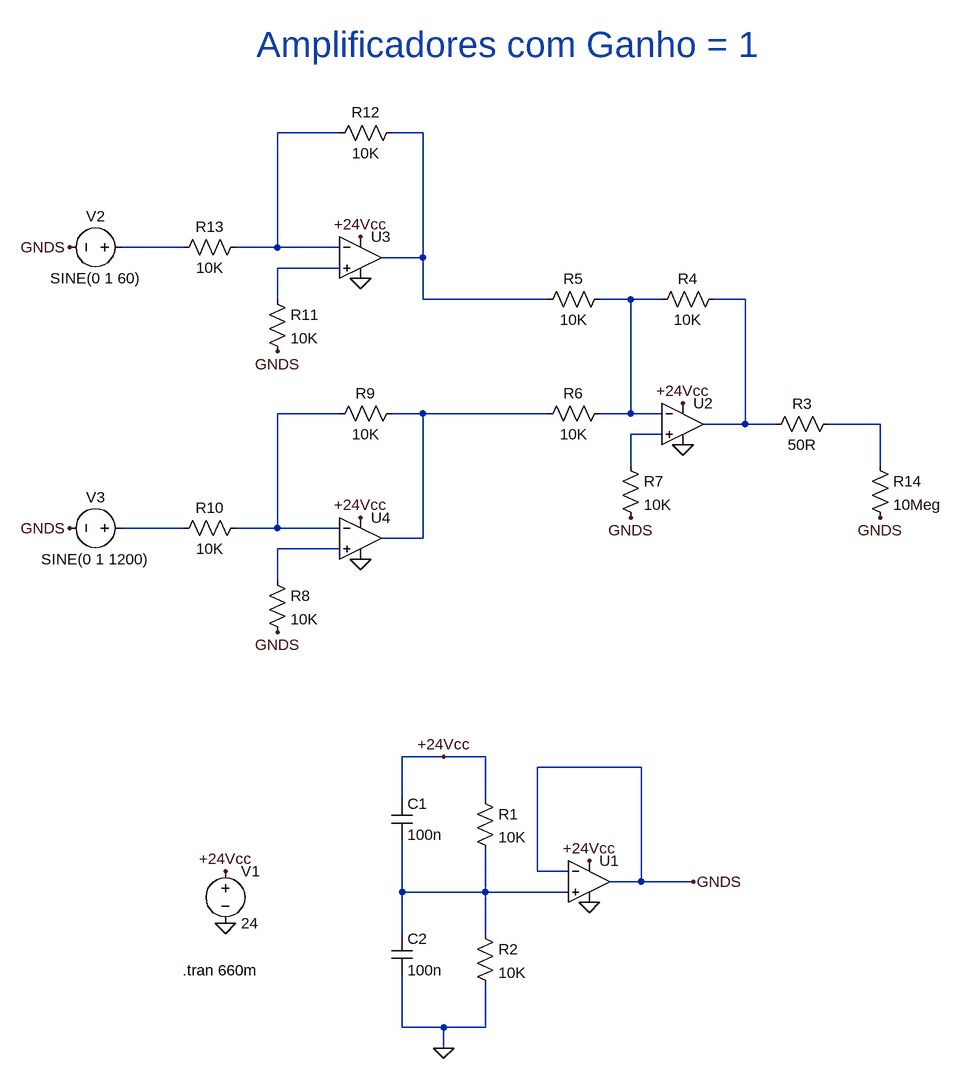
[diagram p0: schematic Simulacao_do_circuito.asc]
Simulacao_do_circuito.asc, the LTspice schematic file:
Version 4
SHEET 1 880 680
WIRE -192 -1168 -288 -1168
WIRE -64 -1168 -112 -1168
WIRE -432 -992 -528 -992
WIRE -288 -992 -288 -1168
WIRE -288 -992 -352 -992
WIRE -192 -992 -288 -992
WIRE -64 -976 -64 -1168
WIRE -64 -976 -128 -976
WIRE -192 -960 -288 -960
WIRE -288 -912 -288 -960
WIRE -64 -912 -64 -976
WIRE 128 -912 -64 -912
WIRE 256 -912 208 -912
WIRE 304 -912 256 -912
WIRE 432 -912 384 -912
WIRE -192 -736 -288 -736
WIRE -64 -736 -112 -736
WIRE 128 -736 -64 -736
WIRE 256 -736 256 -912
WIRE 256 -736 208 -736
WIRE 304 -736 256 -736
WIRE 432 -720 432 -912
WIRE 432 -720 368 -720
WIRE 480 -720 432 -720
WIRE 640 -720 560 -720
WIRE 304 -704 256 -704
WIRE 256 -656 256 -704
WIRE 640 -656 640 -720
WIRE -432 -560 -528 -560
WIRE -288 -560 -288 -736
WIRE -288 -560 -352 -560
WIRE -192 -560 -288 -560
WIRE -64 -544 -64 -736
WIRE -64 -544 -128 -544
WIRE -192 -528 -288 -528
WIRE -288 -480 -288 -528
WIRE -32 -208 -96 -208
WIRE 32 -208 -32 -208
WIRE 272 -192 112 -192
WIRE -96 -144 -96 -208
WIRE 32 -144 32 -208
WIRE 112 -32 112 -192
WIRE 160 -32 112 -32
WIRE 272 -16 272 -192
WIRE 272 -16 224 -16
WIRE 352 -16 272 -16
WIRE -96 0 -96 -80
WIRE 32 0 32 -64
WIRE 32 0 -96 0
WIRE 160 0 32 0
WIRE -96 64 -96 0
WIRE 32 64 32 0
WIRE -96 208 -96 128
WIRE -32 208 -96 208
WIRE 32 208 32 144
WIRE 32 208 -32 208
WIRE -32 240 -32 208
FLAG 336 -752 +24Vcc
FLAG 192 -48 +24Vcc
FLAG -160 -576 +24Vcc
FLAG -160 -512 0
FLAG 192 16 0
FLAG 336 -688 0
FLAG -32 240 0
FLAG -32 -208 +24Vcc
FLAG 352 -16 GNDS
FLAG -368 48 0
FLAG -368 -32 +24Vcc
FLAG 256 -576 GNDS
FLAG -288 -400 GNDS
FLAG -160 -1008 +24Vcc
FLAG -160 -944 0
FLAG -288 -832 GNDS
FLAG 640 -576 GNDS
FLAG -608 -992 GNDS
FLAG -608 -560 GNDS
SYMBOL OpAmps\\UniversalOpAmp 192 -16 R0
SYMATTR InstName U1
SYMBOL OpAmps\\UniversalOpAmp 336 -720 R0
SYMATTR InstName U2
SYMBOL OpAmps\\UniversalOpAmp -160 -544 R0
SYMATTR InstName U4
SYMBOL res 16 -160 R0
SYMATTR InstName R1
SYMATTR Value 10K
SYMBOL res 16 48 R0
SYMATTR InstName R2
SYMATTR Value 10K
SYMBOL cap -112 -144 R0
SYMATTR InstName C1
SYMATTR Value 100n
SYMBOL cap -112 64 R0
SYMATTR InstName C2
SYMATTR Value 100n
SYMBOL voltage -368 -48 R0
WINDOW 123 0 0 Left 0
WINDOW 39 0 0 Left 0
SYMATTR InstName V1
SYMATTR Value 24
SYMBOL res 576 -736 R90
WINDOW 0 0 56 VBottom 2
WINDOW 3 32 56 VTop 2
SYMATTR InstName R3
SYMATTR Value 50R
SYMBOL res 400 -928 R90
WINDOW 0 0 56 VBottom 2
WINDOW 3 32 56 VTop 2
SYMATTR InstName R4
SYMATTR Value 10K
SYMBOL res 224 -928 R90
WINDOW 0 0 56 VBottom 2
WINDOW 3 32 56 VTop 2
SYMATTR InstName R5
SYMATTR Value 10K
SYMBOL res 224 -752 R90
WINDOW 0 0 56 VBottom 2
WINDOW 3 32 56 VTop 2
SYMATTR InstName R6
SYMATTR Value 10K
SYMBOL res 240 -672 R0
SYMATTR InstName R7
SYMATTR Value 10K
SYMBOL res -304 -496 R0
SYMATTR InstName R8
SYMATTR Value 10K
SYMBOL res -96 -752 R90
WINDOW 0 0 56 VBottom 2
WINDOW 3 32 56 VTop 2
SYMATTR InstName R9
SYMATTR Value 10K
SYMBOL res -336 -576 R90
WINDOW 0 0 56 VBottom 2
WINDOW 3 32 56 VTop 2
SYMATTR InstName R10
SYMATTR Value 10K
SYMBOL OpAmps\\UniversalOpAmp -160 -976 R0
SYMATTR InstName U3
SYMBOL res -304 -928 R0
SYMATTR InstName R11
SYMATTR Value 10K
SYMBOL res -96 -1184 R90
WINDOW 0 0 56 VBottom 2
WINDOW 3 32 56 VTop 2
SYMATTR InstName R12
SYMATTR Value 10K
SYMBOL res -336 -1008 R90
WINDOW 0 0 56 VBottom 2
WINDOW 3 32 56 VTop 2
SYMATTR InstName R13
SYMATTR Value 10K
SYMBOL res 624 -672 R0
SYMATTR InstName R14
SYMATTR Value 10Meg
SYMBOL voltage -512 -992 R90
WINDOW 0 -32 56 VBottom 2
WINDOW 3 32 56 VTop 2
WINDOW 123 0 0 Left 0
WINDOW 39 0 0 Left 0
SYMATTR InstName V2
SYMATTR Value SINE(0 1 60)
SYMBOL voltage -512 -560 R90
WINDOW 0 -32 56 VBottom 2
WINDOW 3 32 56 VTop 2
WINDOW 123 0 0 Left 0
WINDOW 39 0 0 Left 0
SYMATTR InstName V3
SYMATTR Value SINE(0 1 1200)
TEXT -434 120 Left 2 !.tran 660m
TEXT -320 -1304 Left 5 ;Amplificadores com Ganho = 1

The netlist it stands for:
* Simulacao_do_circuito.asc
XU1 N013 GNDS +24Vcc 0 GNDS level1 Avol=1Meg GBW=10Meg Vos=0 En=0 Enk=0 In=0 Ink=0 Rin=500Meg  ; pins In+ In- V+ V- OUT
XU2 N010 N005 +24Vcc 0 N006 level1 Avol=1Meg GBW=10Meg Vos=0 En=0 Enk=0 In=0 Ink=0 Rin=500Meg  ; pins In+ In- V+ V- OUT
XU4 N012 N007 +24Vcc 0 N008 level1 Avol=1Meg GBW=10Meg Vos=0 En=0 Enk=0 In=0 Ink=0 Rin=500Meg  ; pins In+ In- V+ V- OUT
R1 +24Vcc N013 10K
R2 N013 0 10K
C1 +24Vcc N013 100n
C2 N013 0 100n
V1 +24Vcc 0 24
R3 N009 N006 50R
R4 N006 N005 10K
R5 N005 N002 10K
R6 N005 N008 10K
R7 N010 GNDS 10K
R8 N012 GNDS 10K
R9 N008 N007 10K
R10 N007 N011 10K
XU3 N004 N001 +24Vcc 0 N002 level1 Avol=1Meg GBW=10Meg Vos=0 En=0 Enk=0 In=0 Ink=0 Rin=500Meg  ; pins In+ In- V+ V- OUT
R11 N004 GNDS 10K
R12 N002 N001 10K
R13 N001 N003 10K
R14 N009 GNDS 10Meg
V2 N003 GNDS SINE(0 1 60)
V3 N011 GNDS SINE(0 1 1200)
.tran 660m
* Amplificadores com Ganho = 1
.lib UniversalOpAmp1.lib
.backanno
.end